# Altium schematic sheet Jack.SchDoc
size A
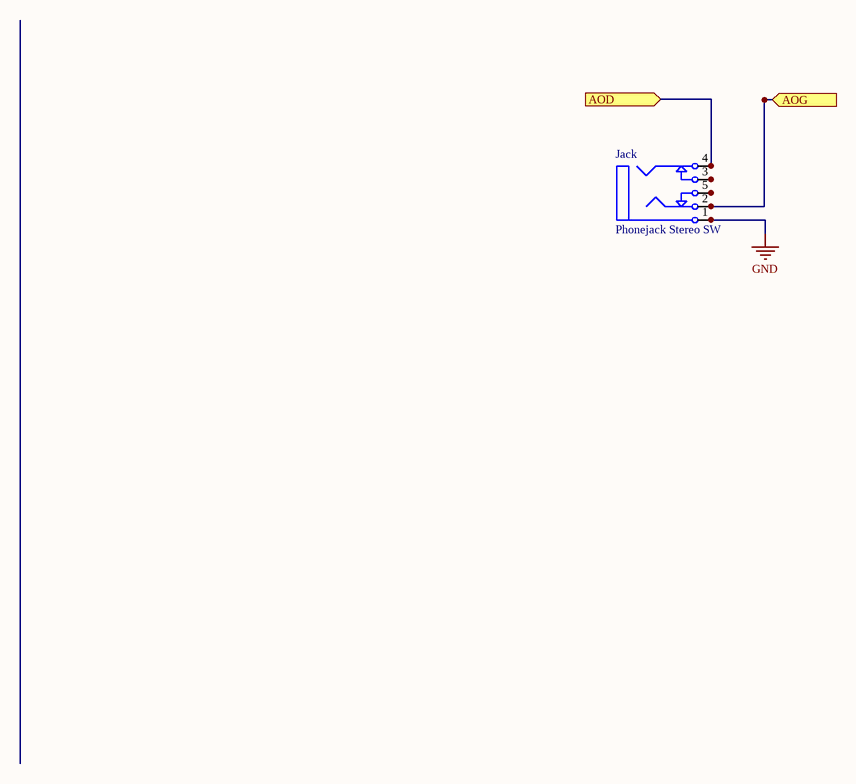
[diagram p0: Jack.SchDoc]

## Parts
Jack  Phonejack Stereo SW  [ST-3150-5N]

## Ports
AOD (in), AOG (in)

## Nets
GND: Jack.1 Jack.1A Jack.1B
AOD: Jack.4 Jack.4A Jack.4B ; port AOD
AOG: Jack.2 Jack.2A Jack.2B ; port AOG
NetJack_3: Jack.3 Jack.3A Jack.3B
NetJack_5: Jack.5 Jack.5A Jack.5B

## Library data of the parts
Jack = Phonejack Stereo SW: 3-Conductor Jack with 2 break contacts (normals) and 2 auxiliary make contacts; Ref constructeur: ACJM-PVB-2S; Constructeur: Amphenol; Vendeur: Farnell